# Altium project Frontend_FD_RJ45.PrjPcb
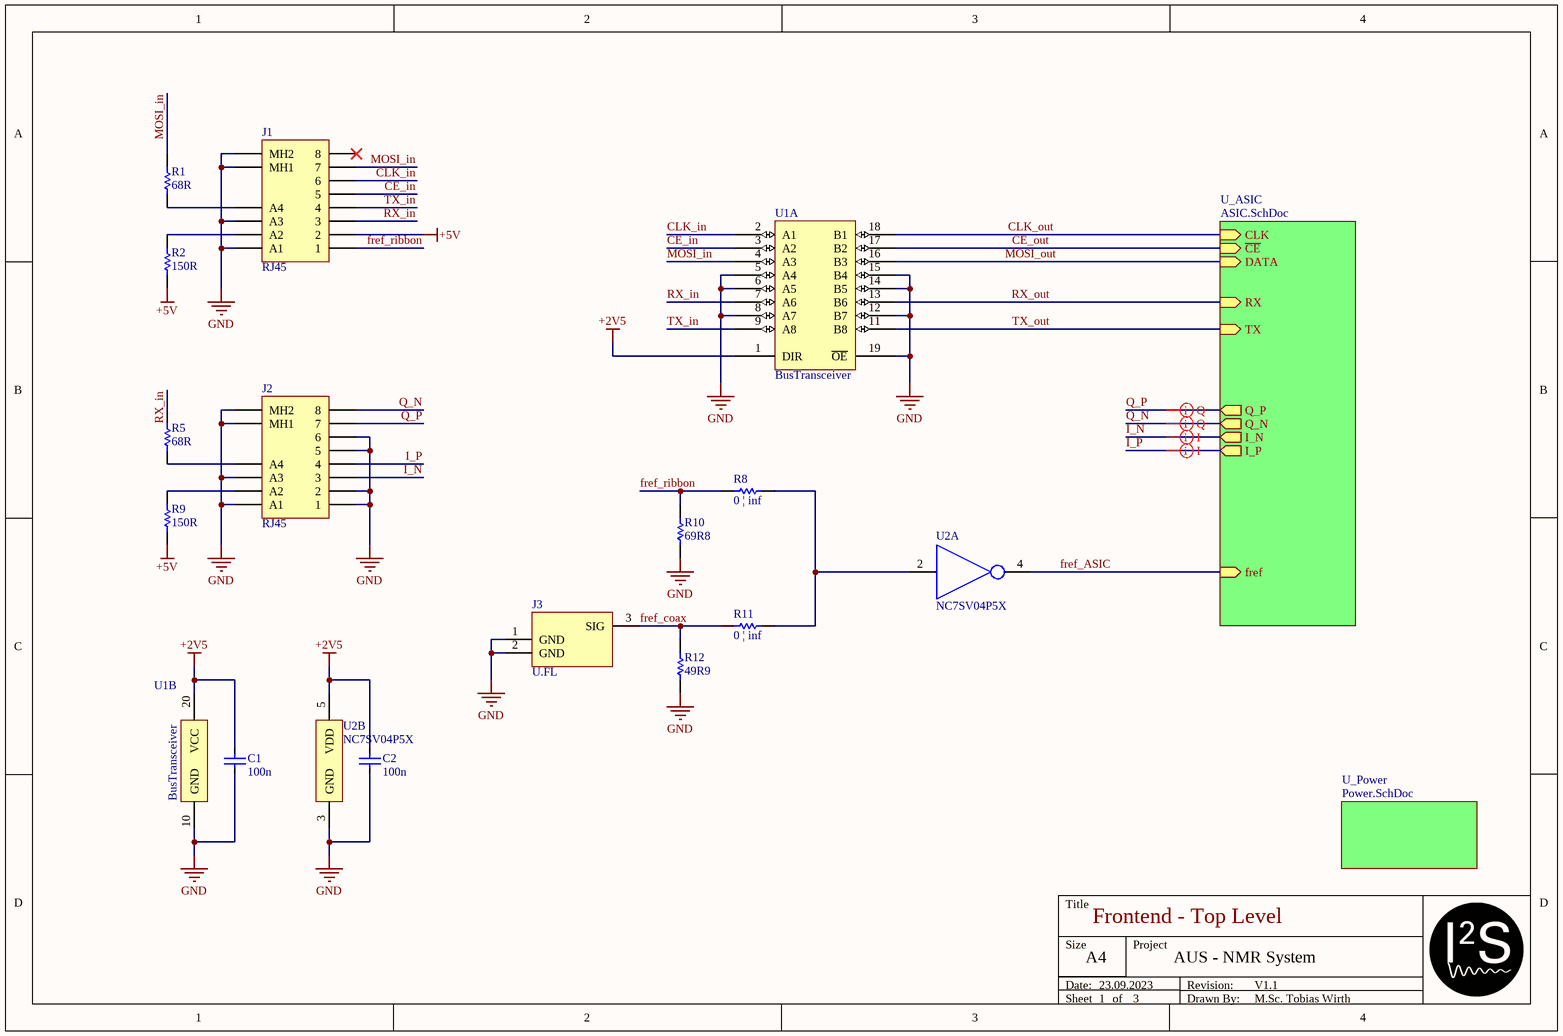
[diagram p0: ASIC-Board.SchDoc]
3 sheets, 37 parts. Net scope: hierarchical (ports join the sheet entries above them; power ports are global).
Board files: ASIC-Board.PcbDoc, ASIC-Board_V2.PcbDoc
Sheets:
  ASIC-Board.SchDoc
    U_Power = Power.SchDoc
    U_ASIC = ASIC.SchDoc

## Sheet ASIC-Board.SchDoc: Frontend - Top Level
size A4; Date: 23.09.2023; ApprovedBy: M.Sc. Tobias Wirth; CheckedBy: M.Sc. Tobias Wirth; Author: M.Sc. Tobias Wirth; CompanyName: University of Stuttgart; DrawnBy: M.Sc. Tobias Wirth; Engineer: M.Sc. Tobias Wirth; Organization: IIS; Address1: Pfaffenwaldring 47; Address2: 70569 Stuttgart; Revision: V1.1; SheetNumber: 1; SheetTotal: 3; ProjectNameAlt: AUS - NMR System; Time: 18:00; ImagePath: N/A; Application_BuildNumber: N/A

### Parts
C1  100n  [CAP_0402]
C2  100n  [CAP_0402]
J1  RJ45  [RJ45 - RJE3A1880412]
J2  RJ45  [RJ45 - RJE3A1880412]
J3  U.FL  [U.FL]
R1  68R  [RES_0603]
R2  150R  [RES_0603]
R5  68R  [RES_0603]
R8  0 | inf  [RES_0402]
R9  150R  [RES_0603]
R10  69R8  [RES_0402]
R11  0 | inf  [RES_0402]
R12  49R9  [RES_0402]
U1  BusTransceiver  [TSSOP-20]  (parts A,B of 2)
U2  NC7SV04P5X  [SOT23-65P210X110-5N]  (parts A,B of 2)

### Sub-sheets
U_ASIC = ASIC.SchDoc: Q_N (out), Q_P (out), I_P (out), I_N (out), CLK (in), ~{CE} (in), DATA (in), fref (in), TX (in), RX (in)
U_Power = Power.SchDoc: no entries

### Nets
+2V5: C1.1 C2.1 U1.1(DIR) U1.20(VCC) U2.5(VDD)
+5V: J1.2 R2.2 R9.2
GND: C1.2 C2.2 J1.A1 J1.A3 J1.MH1 J1.MH2 J2.1 J2.2 J2.5 J2.6 J2.A1 J2.A3 J2.MH1 J2.MH2 J3.1(GND) J3.2(GND) R10.1 R12.1 U1.5(A4) U1.6(A5) U1.8(A7) U1.10(GND) U1.12(B7) U1.14(B5) U1.15(B4) U1.19(~{OE}) U2.3(GND)
CE_in: J1.5 U1.3(A2)
CE_out: U1.17(B2) ; sheet U_ASIC/~{CE}
CLK_in: J1.6 U1.2(A1)
CLK_out: U1.18(B1) ; sheet U_ASIC/CLK
fref_ASIC: U2.4 ; sheet U_ASIC/fref
fref_coax: J3.3(SIG) R11.2 R12.2
fref_ribbon: J1.1 R8.2 R10.2
I_N: J2.3 ; sheet U_ASIC/I_N
I_P: J2.4 ; sheet U_ASIC/I_P
MOSI_in: J1.7 R1.1 U1.4(A3)
MOSI_out: U1.16(B3) ; sheet U_ASIC/DATA
Q_N: J2.8 ; sheet U_ASIC/Q_N
Q_P: J2.7 ; sheet U_ASIC/Q_P
RX_in: J1.3 R5.1 U1.7(A6)
RX_out: U1.13(B6) ; sheet U_ASIC/RX
TX_in: J1.4 U1.9(A8)
TX_out: U1.11(B8) ; sheet U_ASIC/TX
NetJ1_A2: J1.A2 R2.1
NetJ1_A4: J1.A4 R1.2
NetJ2_A2: J2.A2 R9.1
NetJ2_A4: J2.A4 R5.2
NetR8_1: R8.1 R11.1 U2.2

Not connected (* = marked no-connect by the designer): J1 8*

### Layout directives
differential pair; differential pair class IQ; net class Diffnets: I_N, I_P, Q_N, Q_P

### Notes on the sheet
- Title
- Size
- Date:
- Sheet
- A4
- of
- Project
- Drawn By:
- Revision:

### Library data of the parts
C1 C2 = Cap: Supplier: *; Part Number: *; Value: 100n
J1 J2 = RJ45: Ethernet Connectors RJ45 SMT
R1 R2 R5 R8-R12 = Res: Part Number: *; Supplier: *
  R1 R5: Value: 68R
  R2 R9: Value: 150R
  R8 R11: Value: 0 | inf
  R10: Value: 69R8
  R12: Value: 49R9
U1 = 74LVC245A

## Sheet Power.SchDoc: Power / LDOs
size A4; Date: 23.09.2023; ApprovedBy: M.Sc. Tobias Wirth; CheckedBy: M.Sc. Tobias Wirth; Author: M.Sc. Tobias Wirth; CompanyName: University of Stuttgart; DrawnBy: M.Sc. Tobias Wirth; Engineer: M.Sc. Tobias Wirth; Organization: IIS; Address1: Pfaffenwaldring 47; Address2: 70569 Stuttgart; Revision: V1.1; SheetNumber: 1; SheetTotal: 2; ProjectNameAlt: AUS - NMR System; Time: 18:00; ImagePath: N/A; Application_BuildNumber: N/A
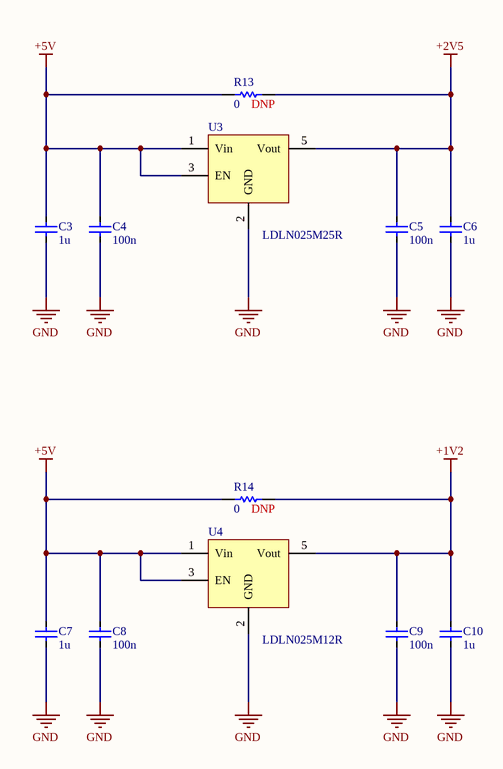
[diagram p1: Power.SchDoc]

### Parts
C3  1u  [CAP_0402]
C4  100n  [CAP_0402]
C5  100n  [CAP_0402]
C6  1u  [CAP_0402]
C7  1u  [CAP_0402]
C8  100n  [CAP_0402]
C9  100n  [CAP_0402]
C10  1u  [CAP_0402]
R13  0  Note: DNP  [RES_0402]
R14  0  Note: DNP  [RES_0402]
U3  LDLN025M25R  [SOT23-95P280X145-5N]
U4  LDLN025M12R  [SOT23-95P280X145-5N]

### Nets
+1V2: C9.1 C10.1 R14.2 U4.5(Vout)
+2V5: C5.1 C6.1 R13.2 U3.5(Vout)
+5V: C3.1 C4.1 C7.1 C8.1 R13.1 R14.1 U3.1(Vin) U3.3(EN) U4.1(Vin) U4.3(EN)
GND: C3.2 C4.2 C5.2 C6.2 C7.2 C8.2 C9.2 C10.2 U3.2(GND) U4.2(GND)

### Notes on the sheet
- Title
- Size
- Date:
- Sheet
- A4
- of
- Project
- Drawn By:
- Revision:

### Library data of the parts
C3-C10 = Cap: Supplier: *; Part Number: *
  C3 C6 C7 C10: Value: 1u
  C4 C5 C8 C9: Value: 100n
R13 R14 = Res: Part Number: *; Supplier: *; Value: 0
U3 U4 = LDLN025MxxR

## Sheet ASIC.SchDoc: Transceiver ASIC
size A4; Date: 23.09.2023; ApprovedBy: M.Sc. Tobias Wirth; CheckedBy: M.Sc. Tobias Wirth; Author: M.Sc. Tobias Wirth; CompanyName: University of Stuttgart; DrawnBy: M.Sc. Tobias Wirth; Engineer: M.Sc. Tobias Wirth; Organization: IIS; Address1: Pfaffenwaldring 47; Address2: 70569 Stuttgart; Revision: V1.1; SheetNumber: 3; SheetTotal: 3; ProjectNameAlt: AUS - NMR System; Time: 18:00; ImagePath: N/A; Application_BuildNumber: N/A
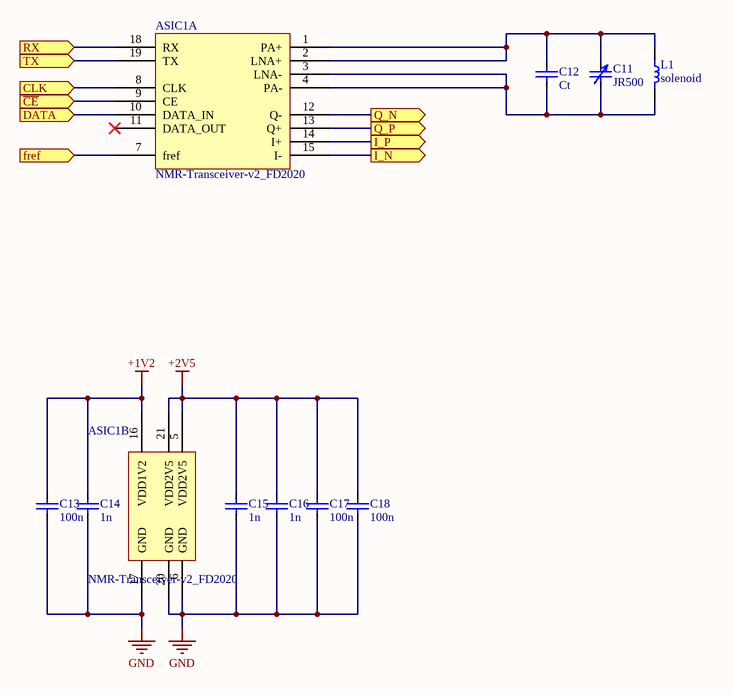
[diagram p2: ASIC.SchDoc]

### Parts
ASIC1  NMR-Transceiver-v2_FD2020  [NMR-Transceiver-FD2020_Interposer-BGA]  (parts A,B of 2)
C11  JR500  [Cap_var]
C12  Ct  [CAP_0402]
C13  100n  [CAP_0402]
C14  1n  [CAP_0402]
C15  1n  [CAP_0402]
C16  1n  [CAP_0402]
C17  100n  [CAP_0402]
C18  100n  [CAP_0402]
L1  solenoid  [Ind_1206]

### Ports
CLK (in), DATA (in), fref (in), I_N (out), I_P (out), Q_N (out), Q_P (out), RX (in), TX (in), ~{CE} (in)

### Nets
+1V2: ASIC1.16(VDD1V2) C13.1 C14.1
+2V5: ASIC1.5(VDD2V5) ASIC1.21(VDD2V5) C15.1 C16.1 C17.1 C18.1
GND: ASIC1.6(GND) ASIC1.17(GND) ASIC1.20(GND) C13.2 C14.2 C15.2 C16.2 C17.2 C18.2
CE_out: ASIC1.9(CE) ; port ~{CE}
CLK_out: ASIC1.8(CLK) ; port CLK
fref_ASIC: ASIC1.7(fref) ; port fref
I_N: ASIC1.15(I-) ; port I_N
I_P: ASIC1.14(I+) ; port I_P
MOSI_out: ASIC1.10(DATA_IN) ; port DATA
Q_N: ASIC1.12(Q-) ; port Q_N
Q_P: ASIC1.13(Q+) ; port Q_P
RX_out: ASIC1.18(RX) ; port RX
TX_out: ASIC1.19(TX) ; port TX
NetASIC1_1: ASIC1.1(PA+) ASIC1.2(LNA+) C11.1 C12.1 L1.1
NetASIC1_3: ASIC1.3(LNA-) ASIC1.4(PA-) C11.2 C12.2 L1.2

Not connected (* = marked no-connect by the designer): ASIC1 11(DATA_OUT)*

### Notes on the sheet
- Title
- Size
- Date:
- Sheet
- A4
- of
- Project
- Drawn By:
- Revision:

### Library data of the parts
C11 = Cap_var: Supplier: *; Part Number: *; Value: JR500
C12-C18 = Cap: Supplier: *; Part Number: *
  C12: Value: Ct
  C13 C17 C18: Value: 100n
  C14-C16: Value: 1n
L1 = Ind: Part Number: *; Supplier: *; Value: solenoid

## Nets that join several sheets
+1V2: Power (C9.1 C10.1 R14.2 U4.5), ASIC (ASIC1.16 C13.1 C14.1)
+2V5: ASIC-Board (5 pins), Power (C5.1 C6.1 R13.2 U3.5), ASIC (6 pins)
+5V: ASIC-Board (J1.2 R2.2 R9.2), Power (10 pins)
GND: ASIC-Board (27 pins), Power (10 pins), ASIC (9 pins)
CE_out: ASIC-Board (U1.17), ASIC (ASIC1.9)
CLK_out: ASIC-Board (U1.18), ASIC (ASIC1.8)
fref_ASIC: ASIC-Board (U2.4), ASIC (ASIC1.7)
I_N: ASIC-Board (J2.3), ASIC (ASIC1.15)
I_P: ASIC-Board (J2.4), ASIC (ASIC1.14)
MOSI_out: ASIC-Board (U1.16), ASIC (ASIC1.10)
Q_N: ASIC-Board (J2.8), ASIC (ASIC1.12)
Q_P: ASIC-Board (J2.7), ASIC (ASIC1.13)
RX_out: ASIC-Board (U1.13), ASIC (ASIC1.18)
TX_out: ASIC-Board (U1.11), ASIC (ASIC1.19)